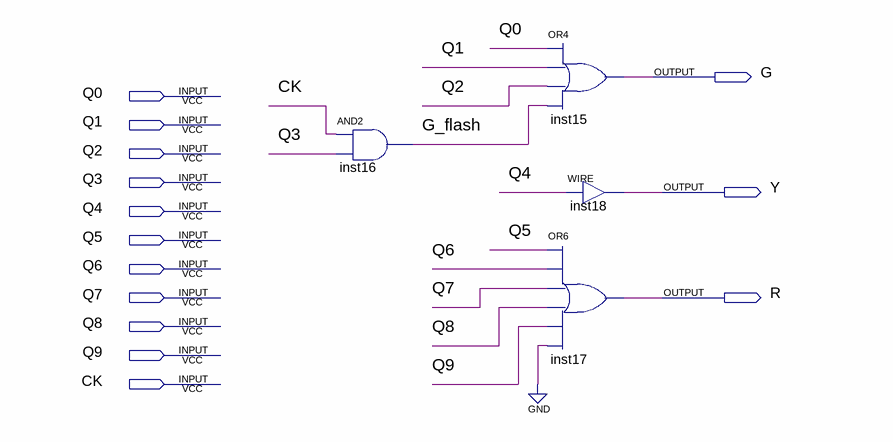
[diagram p0: schematic sheet]
// Quartus schematic Traffic_lights_decoder.bdf as structural Verilog: 4 symbols, 14 pins
module Traffic_lights_decoder (
  input  Q0,
  input  Q1,
  input  Q2,
  input  Q3,
  input  Q4,
  input  Q5,
  input  Q6,
  input  Q7,
  input  Q8,
  input  Q9,
  input  CK,
  output G,
  output Y,
  output R
);

  wire G_flash;

  and inst16 (G_flash, CK, Q3);
  or inst15 (G, Q0, Q1, Q2, G_flash);
  assign Y = Q4;  // WIRE inst18
  or inst17 (R, Q5, Q6, Q7, Q8, Q9, 1'b0);
endmodule
